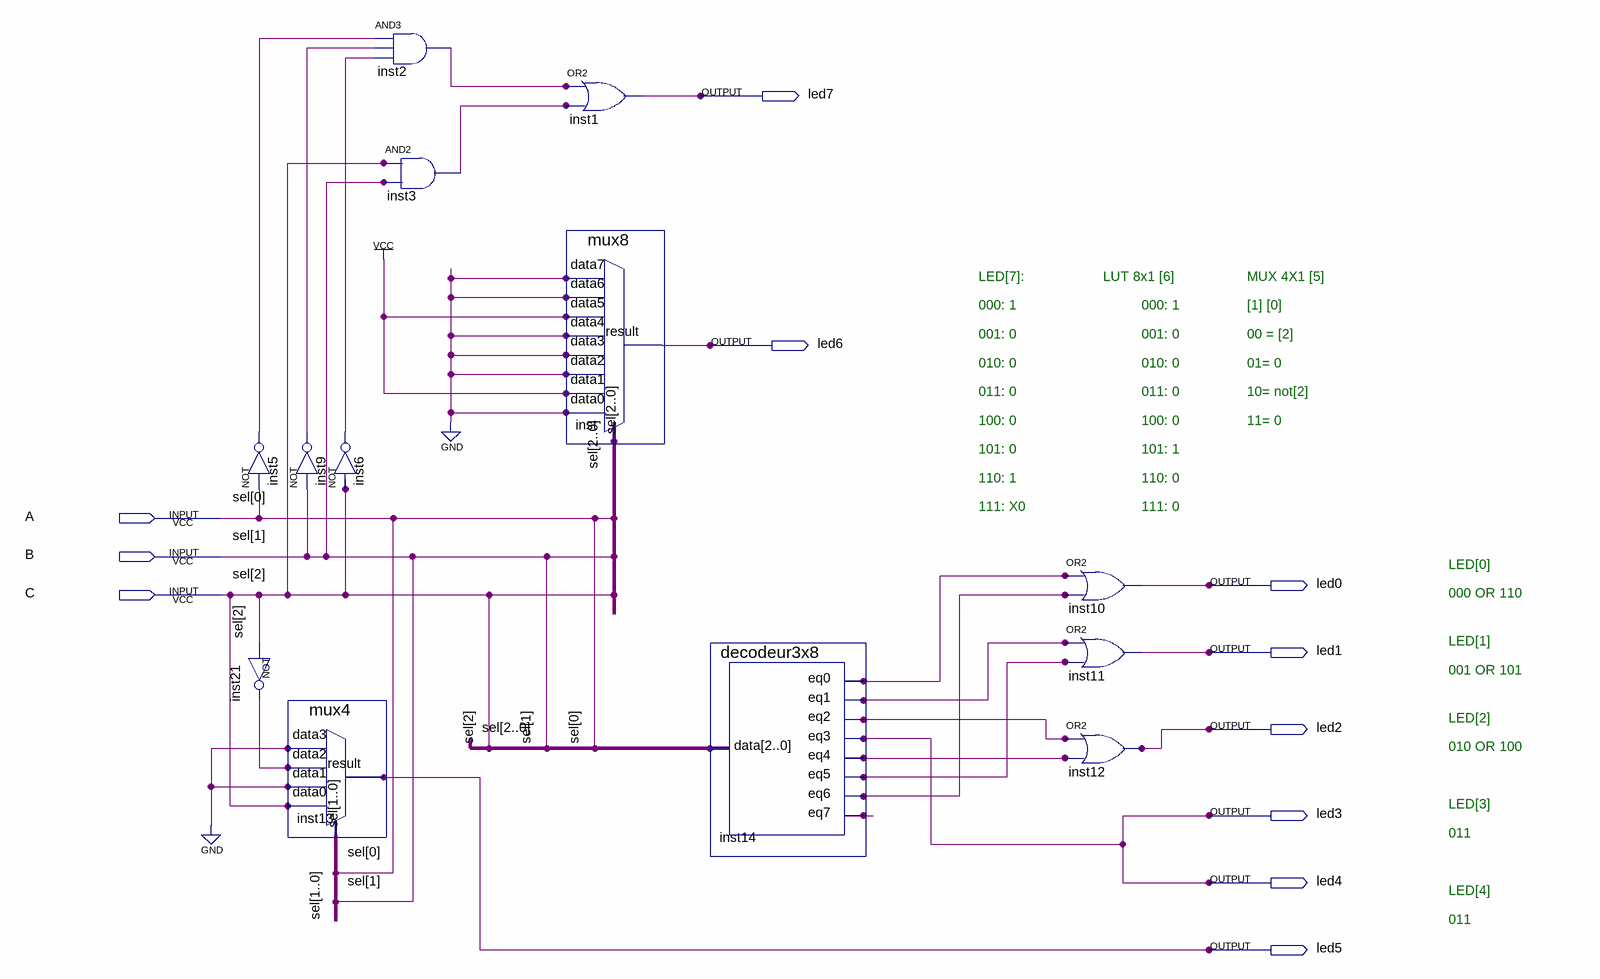
[diagram p0: schematic sheet]
// Quartus schematic guirlandes_controller.bdf as structural Verilog: 13 symbols, 11 pins
module guirlandes_controller (
  input  A,
  input  B,
  input  C,
  output led7,
  output led6,
  output led0,
  output led1,
  output led2,
  output led3,
  output led4,
  output led5
);

  wire inst2_out, inst3_out, inst5_out, inst6_out, inst9_out, inst14_eq0, inst14_eq1, inst14_eq2, inst14_eq4,
       inst14_eq5, inst14_eq6, inst14_eq7, inst21_out;

  not inst5 (inst5_out, A);
  not inst9 (inst9_out, B);
  not inst21 (inst21_out, C);
  mux4 inst13 (.data3(1'b0), .data2(inst21_out), .data1(1'b0), .data0(C), .sel({B, A}), .result(led5));
  and inst2 (inst2_out, inst5_out, inst9_out, inst6_out);
  not inst6 (inst6_out, C);
  and inst3 (inst3_out, C, B);
  or inst1 (led7, inst2_out, inst3_out);
  mux8 inst (
    .data7(1'b0), .data6(1'b0), .data5(1'b1), .data4(1'b0), .data3(1'b0), .data2(1'b0), .data1(1'b1),
    .data0(1'b0), .sel({C, B, A}), .result(led6));
  decodeur3x8 inst14 (
    .data({C, B, A}), .eq0(inst14_eq0), .eq1(inst14_eq1), .eq2(inst14_eq2), .eq3(led3), .eq4(inst14_eq4),
    .eq5(inst14_eq5), .eq6(inst14_eq6), .eq7(inst14_eq7));
  or inst10 (led0, inst14_eq0, inst14_eq6);
  or inst11 (led1, inst14_eq1, inst14_eq5);
  or inst12 (led2, inst14_eq2, inst14_eq4);

  assign led4 = led3;

  // Other names for the same wires on the sheet: sel[2:0] = {C, B, A}

  // Notes on the sheet:
  //   LED[7]:
  //   LUT 8x1 [6] 
  //   MUX 4X1 [5]
  //   000: 1
  //   000: 1
  //   [1] [0]
  //   001: 0
  //   001: 0
  //   00 = [2]
  //   010: 0
  //   010: 0
  //   01= 0
  //   011: 0
  //   011: 0
  //   10= not[2]
  //   100: 0
  //   100: 0
  //   11= 0
  //   101: 0
  //   101: 1
  //   110: 1
  //   110: 0
  //   111: X0
  //   111: 0
  //   LED[0]
  //   000 OR 110
  //   LED[1]
  //   001 OR 101
  //   LED[2]
  //   010 OR 100 
  //   LED[3]
  //   011
  //   LED[4]
  //   011
endmodule
